# Altium schematic sheet 24V Multiphase Buck.SchDoc: 24V Multiphase Buck
size Tabloid; DrawnBy: Paul Kokhanov; Organization: UWRT; Revision: 2.0; SheetNumber: 1; SheetTotal: 1
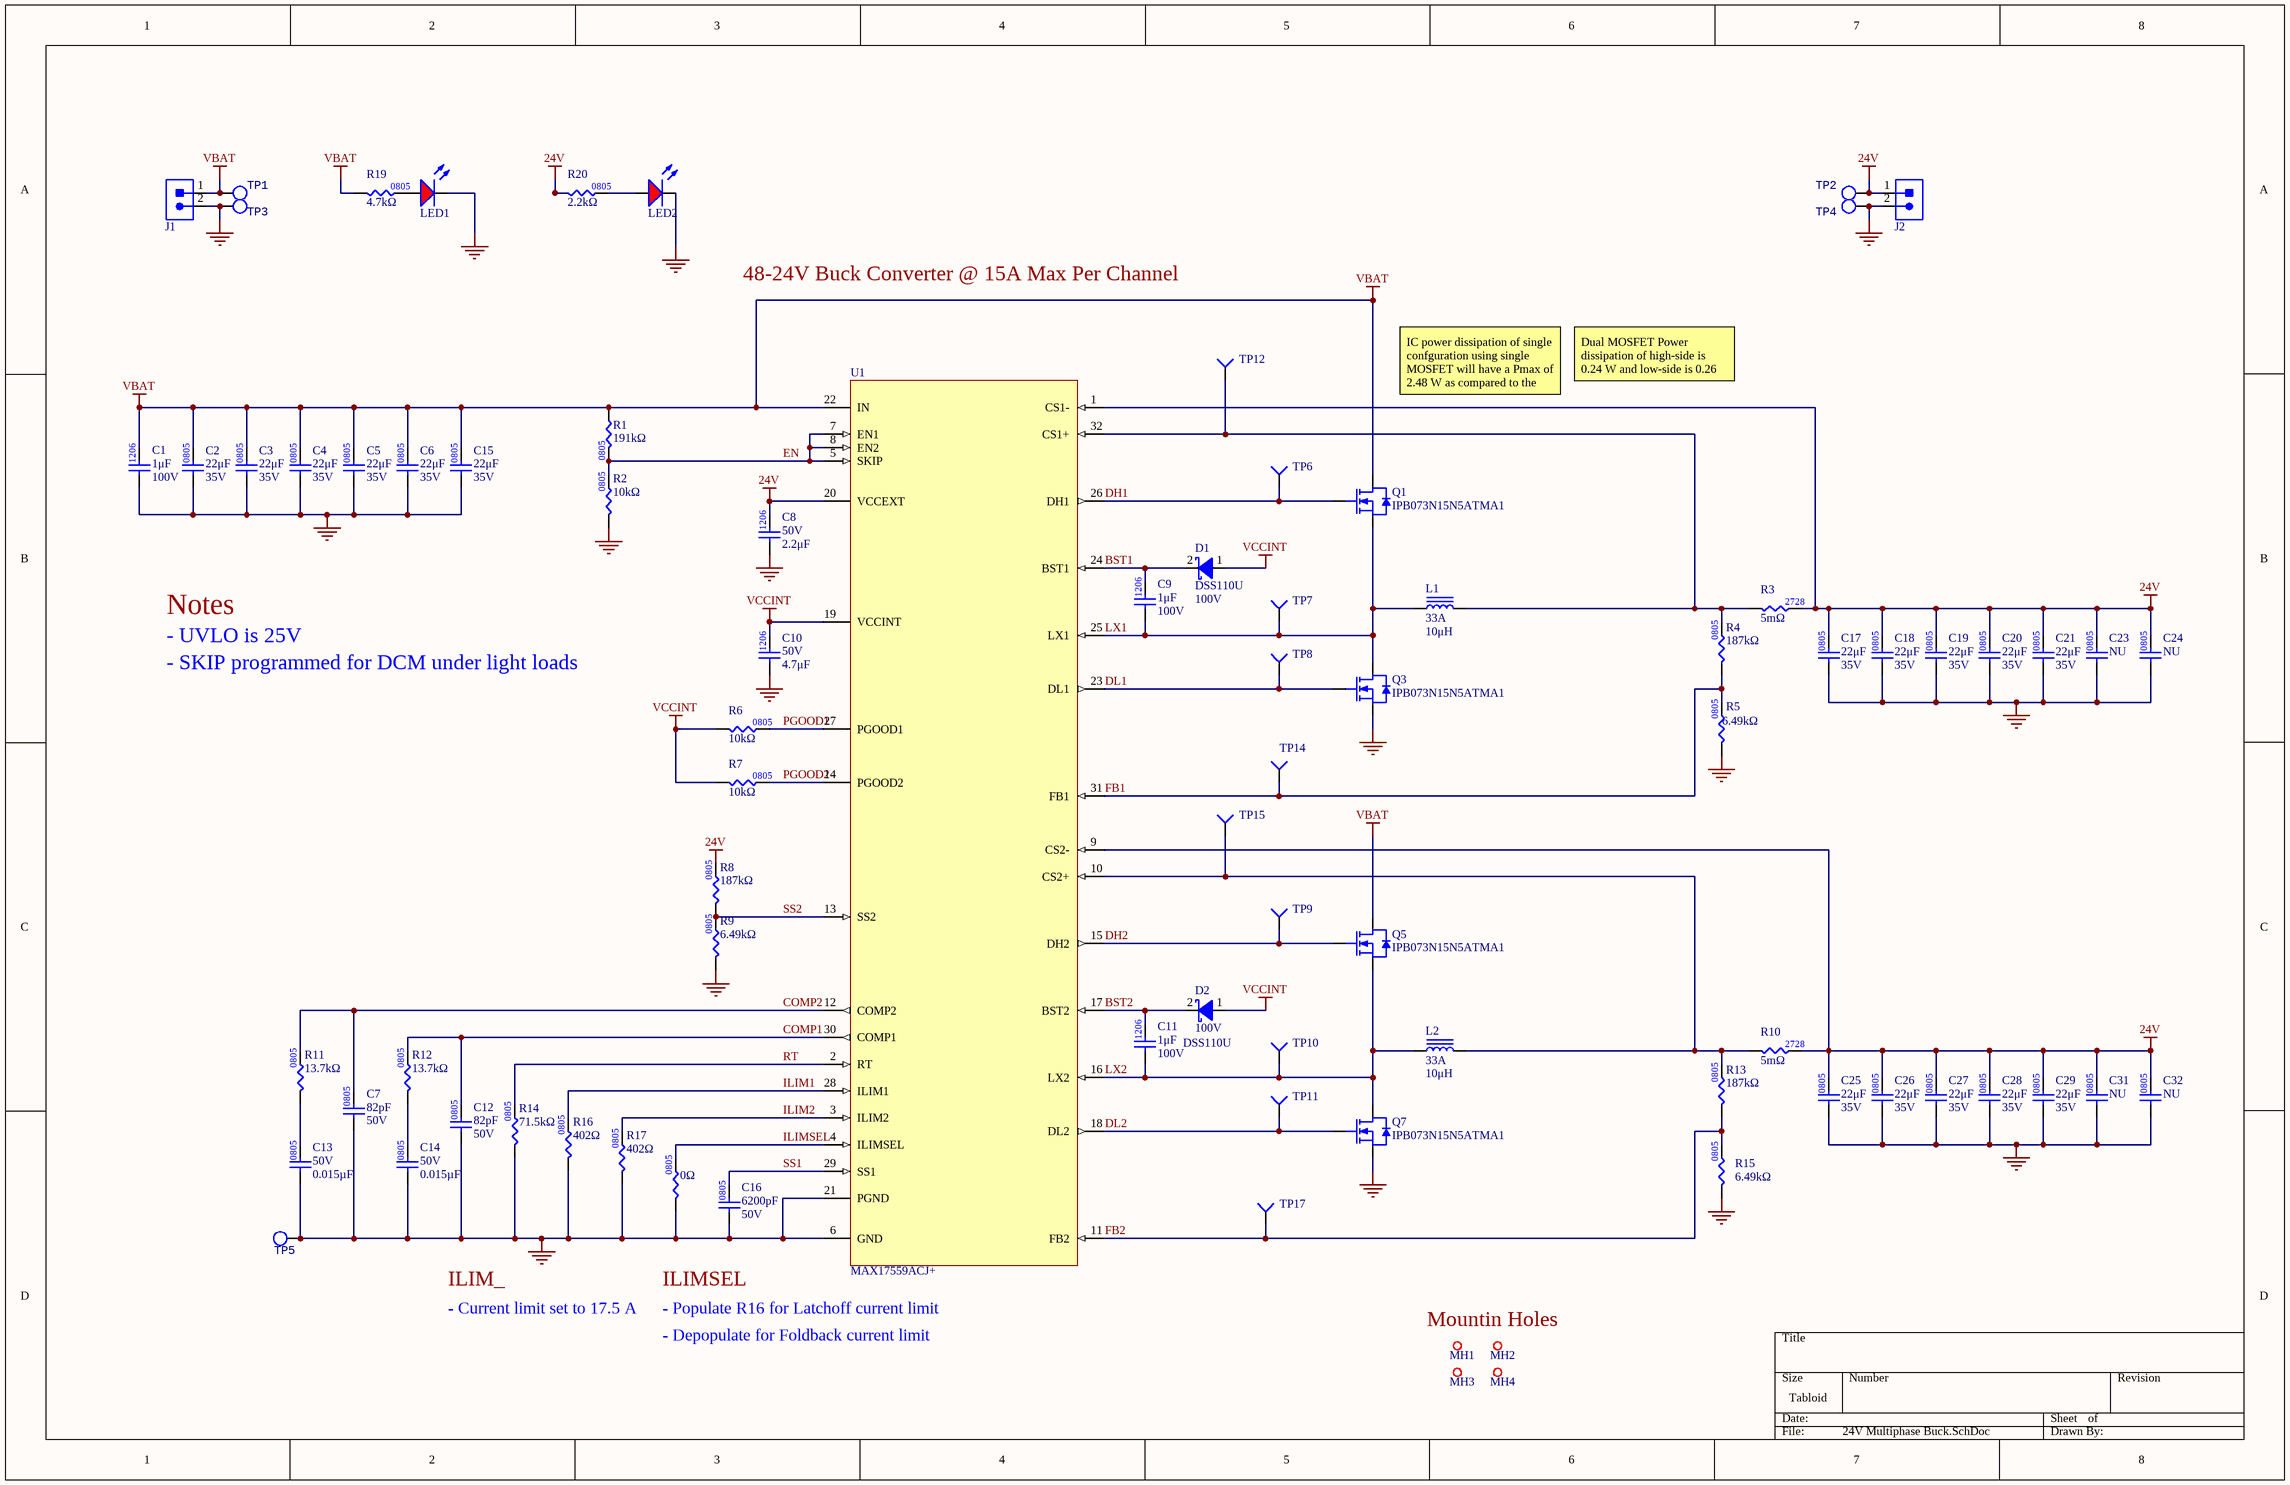
[diagram p0: 24V Multiphase Buck.SchDoc]

## Parts
C1  value 1μF  Voltage Rating: 100V  [CAPC3216X190X50NL20T25]  (hidden comment: CAP_1uF_100V_1206)
C2  value 22μF  Voltage Rating: 35V  [CAP1206]  (hidden comment: CAP_22uF_35V_1206)
C3  value 22μF  Voltage Rating: 35V  [CAP1206]  (hidden comment: CAP_22uF_35V_1206)
C4  value 22μF  Voltage Rating: 35V  [CAP1206]  (hidden comment: CAP_22uF_35V_1206)
C5  value 22μF  Voltage Rating: 35V  [CAP1206]  (hidden comment: CAP_22uF_35V_1206)
C6  value 22μF  Voltage Rating: 35V  [CAP1206]  (hidden comment: CAP_22uF_35V_1206)
C7  value 82pF  Voltage Rating: 50V  [CAP0603]  (hidden comment: CAP_82pF_50V_0603)
C8  value 2.2μF  Voltage Rating: 50V  [CAP1206]  (hidden comment: CAP_2.2uF_50V_1206)
C9  value 1μF  Voltage Rating: 100V  [CAPC3216X190X50NL20T25]  (hidden comment: CAP_1uF_100V_1206)
C10  value 4.7μF  Voltage Rating: 50V  [CAP1206]  (hidden comment: CAP_4.7uF_50V_1206)
C11  value 1μF  Voltage Rating: 100V  [CAPC3216X190X50NL20T25]  (hidden comment: CAP_1uF_100V_1206)
C12  value 82pF  Voltage Rating: 50V  [CAP0603]  (hidden comment: CAP_82pF_50V_0603)
C13  value 0.015µF  Voltage Rating: 50V  [CAP0805]  (hidden comment: CAP_0.015uF_50V_0805)
C14  value 0.015µF  Voltage Rating: 50V  [CAP0805]  (hidden comment: CAP_0.015uF_50V_0805)
C15  value 22μF  Voltage Rating: 35V  [CAP1206]  (hidden comment: CAP_22uF_35V_1206)
C16  Capacitance: 6200pF  Voltage Rating: 50V  [CAP0805]  (hidden comment: CAP_6200pF_50V_0805)
C17  value 22μF  Voltage Rating: 35V  [CAP1206]  (hidden comment: CAP_22uF_35V_1206)
C18  value 22μF  Voltage Rating: 35V  [CAP1206]  (hidden comment: CAP_22uF_35V_1206)
C19  value 22μF  Voltage Rating: 35V  [CAP1206]  (hidden comment: CAP_22uF_35V_1206)
C20  value 22μF  Voltage Rating: 35V  [CAP1206]  (hidden comment: CAP_22uF_35V_1206)
C21  value 22μF  Voltage Rating: 35V  [CAP1206]  (hidden comment: CAP_22uF_35V_1206)
C23  value NU  [CAP1206]  (hidden comment: CAP_NU_1206)
C24  value NU  [CAP1206]  (hidden comment: CAP_NU_1206)
C25  value 22μF  Voltage Rating: 35V  [CAP1206]  (hidden comment: CAP_22uF_35V_1206)
C26  value 22μF  Voltage Rating: 35V  [CAP1206]  (hidden comment: CAP_22uF_35V_1206)
C27  value 22μF  Voltage Rating: 35V  [CAP1206]  (hidden comment: CAP_22uF_35V_1206)
C28  value 22μF  Voltage Rating: 35V  [CAP1206]  (hidden comment: CAP_22uF_35V_1206)
C29  value 22μF  Voltage Rating: 35V  [CAP1206]  (hidden comment: CAP_22uF_35V_1206)
C31  value NU  [CAP1206]  (hidden comment: CAP_NU_1206)
C32  value NU  [CAP1206]  (hidden comment: CAP_NU_1206)
D1  Manufacturer Part Number 1: DSS110U  Vr (Max): 100V  [SOD-123FL]  (hidden comment: DIO_SCHOTTKY_100V_1A)
D2  Manufacturer Part Number 1: DSS110U  Vr (Max): 100V  [SOD-123FL]  (hidden comment: DIO_SCHOTTKY_100V_1A)
J1  CON_2POS_SCREW_TERM  [CON_2POS_SCREW_TERM_65A]  (value not drawn)
J2  CON_2POS_SCREW_TERM  [CON_2POS_SCREW_TERM_65A]  (value not drawn)
L1  Current Rating: 33A  Inductance: 10μH  [IND_B82559B7103A027]  (hidden comment: IND_10uH_33A_SMD)
L2  Current Rating: 33A  Inductance: 10μH  [IND_B82559B7103A027]  (hidden comment: IND_10uH_33A_SMD)
LED1  LED_RED  [LED_0805_RED]  (value not drawn)
LED2  LED_RED  [LED_0805_RED]  (value not drawn)
MH1  MOUNTING_HOLE_M3  [MOUNTING_HOLE_3mm]  (value not drawn)  (no BOM)
MH2  MOUNTING_HOLE_M3  [MOUNTING_HOLE_3mm]  (value not drawn)  (no BOM)
MH3  MOUNTING_HOLE_M3  [MOUNTING_HOLE_3mm]  (value not drawn)  (no BOM)
MH4  MOUNTING_HOLE_M3  [MOUNTING_HOLE_3mm]  (value not drawn)  (no BOM)
Q1  Manufacturer Part Number 1: IPB073N15N5ATMA1  [NMOS_DPAK263-3-2]  (hidden comment: NMOS_150V_114A)
Q3  Manufacturer Part Number 1: IPB073N15N5ATMA1  [NMOS_DPAK263-3-2]  (hidden comment: NMOS_150V_114A)
Q5  Manufacturer Part Number 1: IPB073N15N5ATMA1  [NMOS_DPAK263-3-2]  (hidden comment: NMOS_150V_114A)
Q7  Manufacturer Part Number 1: IPB073N15N5ATMA1  [NMOS_DPAK263-3-2]  (hidden comment: NMOS_150V_114A)
R1  value 191kΩ  [RES0805]  (hidden comment: RES_191kΩ_0805_1%)
R2  value 10kΩ  [RES0805]  (hidden comment: RES_10kΩ_0805_5%)
R3  value 5mΩ  [RES2728]  (hidden comment: RES_5mΩ_2728_1%)
R4  value 187kΩ  [RES0805]  (hidden comment: RES_187kΩ_0805_0.1%)
R5  value 6.49kΩ  [RES0805]  (hidden comment: RES_6.49kΩ_0805_1%)
R6  value 10kΩ  [RES0805]  (hidden comment: RES_10kΩ_0805_5%)
R7  value 10kΩ  [RES0805]  (hidden comment: RES_10kΩ_0805_5%)
R8  value 187kΩ  [RES0805]  (hidden comment: RES_187kΩ_0805_0.1%)
R9  value 6.49kΩ  [RES0805]  (hidden comment: RES_6.49kΩ_0805_1%)
R10  value 5mΩ  [RES2728]  (hidden comment: RES_5mΩ_2728_1%)
R11  value 13.7kΩ  [RES0805]  (hidden comment: RES_13.7kΩ_0805_1%)
R12  value 13.7kΩ  [RES0805]  (hidden comment: RES_13.7kΩ_0805_1%)
R13  value 187kΩ  [RES0805]  (hidden comment: RES_187kΩ_0805_0.1%)
R14  value 71.5kΩ  [RES0805]  (hidden comment: RES_71.5kΩ_0805_1%)
R15  value 6.49kΩ  [RES0805]  (hidden comment: RES_6.49kΩ_0805_1%)
R16  value 402Ω  [RES0805]  (hidden comment: RES_402Ω_0805_1%)
R17  value 402Ω  [RES0805]  (hidden comment: RES_402Ω_0805_1%)
R18  value 0Ω  [RES0805]  (hidden comment: RES_0Ω_0805)
R19  value 4.7kΩ  [RES0805]  (hidden comment: RES_4.7kΩ_0805_5%)
R20  value 2.2kΩ  [RES0805]  (hidden comment: RES_2.2kΩ_0805_5%)
TP1  TESTPOINT_LOOP  [TESTPOINT_LOOP]  (value not drawn)
TP2  TESTPOINT_LOOP  [TESTPOINT_LOOP]  (value not drawn)
TP3  TESTPOINT_LOOP  [TESTPOINT_LOOP]  (value not drawn)
TP4  TESTPOINT_LOOP  [TESTPOINT_LOOP]  (value not drawn)
TP5  TESTPOINT_LOOP  [TESTPOINT_LOOP]  (value not drawn)
TP6  TESTPOINT_1MM_CIRCLE  [TESTPOINT_CIRCLE_1MM]  (value not drawn)  (no BOM)
TP7  TESTPOINT_1MM_CIRCLE  [TESTPOINT_CIRCLE_1MM]  (value not drawn)  (no BOM)
TP8  TESTPOINT_1MM_CIRCLE  [TESTPOINT_CIRCLE_1MM]  (value not drawn)  (no BOM)
TP9  TESTPOINT_1MM_CIRCLE  [TESTPOINT_CIRCLE_1MM]  (value not drawn)  (no BOM)
TP10  TESTPOINT_1MM_CIRCLE  [TESTPOINT_CIRCLE_1MM]  (value not drawn)  (no BOM)
TP11  TESTPOINT_1MM_CIRCLE  [TESTPOINT_CIRCLE_1MM]  (value not drawn)  (no BOM)
TP12  TESTPOINT_1MM_CIRCLE  [TESTPOINT_CIRCLE_1MM]  (value not drawn)  (no BOM)
TP14  TESTPOINT_1MM_CIRCLE  [TESTPOINT_CIRCLE_1MM]  (value not drawn)  (no BOM)
TP15  TESTPOINT_1MM_CIRCLE  [TESTPOINT_CIRCLE_1MM]  (value not drawn)  (no BOM)
TP17  TESTPOINT_1MM_CIRCLE  [TESTPOINT_CIRCLE_1MM]  (value not drawn)  (no BOM)
U1  MAX17559ACJ+  [IC_32-TQFP]

## Nets
24V: C8.2 C17.2 C18.2 C19.2 C20.2 C21.2 C23.2 C24.2 C25.2 C26.2 C27.2 C28.2 C29.2 C31.2 C32.2 J2.1 R3.2 R8.2 R10.2 R20.1 TP2.1 U1.1(CS1-) U1.9(CS2-) U1.20(VCCEXT)
GND: C1.1 C2.1 C3.1 C4.1 C5.1 C6.1 C7.1 C8.1 C10.1 C12.1 C13.1 C14.1 C15.1 C16.1 C17.1 C18.1 C19.1 C20.1 C21.1 C23.1 C24.1 C25.1 C26.1 C27.1 C28.1 C29.1 C31.1 C32.1 J1.2 J2.2 LED1.2(K) LED2.2(K) Q3.3(SOURCE) Q7.3(SOURCE) R2.1 R5.1 R9.1 R14.1 R15.1 R16.1 R17.1 R18.1 TP3.1 TP4.1 TP5.1 U1.6(GND) U1.21(PGND)
VBAT: C1.2 C2.2 C3.2 C4.2 C5.2 C6.2 C15.2 J1.1 Q1.2(DRAIN) Q5.2(DRAIN) R1.2 R19.1 TP1.1 U1.22(IN)
VCCINT: C10.2 D1.1(Anode) D2.1(Anode) R6.1 R7.1 U1.19(VCCINT)
BST1: C9.2 D1.2(Cathode) U1.24(BST1)
BST2: C11.2 D2.2(Cathode) U1.17(BST2)
COMP1: C12.2 R12.2 U1.30(COMP1)
COMP2: C7.2 R11.2 U1.12(COMP2)
DH1: Q1.1(GATE) TP6.1(=value) U1.26(DH1)
DH2: Q5.1(GATE) TP9.1(=value) U1.15(DH2)
DL1: Q3.1(GATE) TP8.1(=value) U1.23(DL1)
DL2: Q7.1(GATE) TP11.1(=value) U1.18(DL2)
EN: R1.1 R2.2 U1.5(SKIP) U1.7(EN1) U1.8(EN2)
FB1: R4.1 R5.2 TP14.1(=value) U1.31(FB1)
FB2: R13.1 R15.2 TP17.1(=value) U1.11(FB2)
ILIM1: R16.2 U1.28(ILIM1)
ILIM2: R17.2 U1.3(ILIM2)
ILIMSEL: R18.2 U1.4(ILIMSEL)
LX1: C9.1 L1.1 Q1.3(SOURCE) Q3.2(DRAIN) TP7.1(=value) U1.25(LX1)
LX2: C11.1 L2.1 Q5.3(SOURCE) Q7.2(DRAIN) TP10.1(=value) U1.16(LX2)
PGOOD1: R6.2 U1.27(PGOOD1)
PGOOD2: R7.2 U1.14(PGOOD2)
RT: R14.2 U1.2(RT)
SS1: C16.2 U1.29(SS1)
SS2: R8.1 R9.2 U1.13(SS2)
NetC13_2: C13.2 R11.1
NetC14_2: C14.2 R12.1
NetL1_2: L1.2 R3.1 R4.2 TP12.1(=value) U1.32(CS1+)
NetL2_2: L2.2 R10.1 R13.2 TP15.1(=value) U1.10(CS2+)
NetLED1_1: LED1.1(A) R19.2
NetLED2_1: LED2.1(A) R20.2

## Notes on the sheet
- 48-24V Buck Converter @ 15A Max Per Channel
- IC power dissipation of single confguration using single MOSFET will have a Pmax of 2.48 W as compared to the Dual MOSFET with Pmax of 4.77 W. The concern with the dual configuration is the the IC junction temperature is 178 degrees, whereas as per the MAX17559 information sheet suggests we do not exceed a TJ of 125 degrees. The single configuration has a TJ of 111 degrees. Having a high TJ can cause functionality and preformance issues. Essentially we would have to monitor this or use some cooling method or change the switching frequency.
- Dual MOSFET Power dissipation of high-side is 0.24 W and low-side is 0.26 W. Single MOSFET Power dissipation of high-side is 0.96 W and low-side is 0.86 W. It is desirable to have a lower Power dissipation, hence overall, since space is not a concern on this design, we should keep both MOSFETS but one shall be blank.
- Notes
- - SKIP programmed for DCM under light loads
- - UVLO is 25V
- ILIM_
- ILIMSEL
- - Current limit set to 17.5 A
- - Populate R16 for Latchoff current limit
- - Depopulate for Foldback current limit
- Mountin Holes
- (in symbol CAP_2.2uF_50V_1206) 1206
- (in symbol CAP_22uF_35V_1206) 0805
- (in symbol CAP_82pF_50V_0603) 0805
- (in symbol CAP_NU_1206) 0805

## Library data of the parts
C1 C9 C11 = CAP_1uF_100V_1206: CAP CER 1UF 100V X7R 1206; Supplier 1: Digi-Key; Mounting Type: SMD; Package: 1206; Supplier Part Number 1: 490-16468-1-ND
C2-C6 C15 C17-C21 C25-C29 = CAP_22uF_35V_1206: CAP CER 22UF 35V X5R 1206; Manufacturer 1: TDK Corporation; Manufacturer Part Number 1: C3216X5R1V226M160AC; Package/Footprint: 1205; Mounting Type: Surface Mount; Supplier 1: Digi-Key; Supplier Part Number 1: 445-8045-1-ND; Dielectric: X5R
C7 C12 = CAP_82pF_50V_0603: CAP CER 82PF 50V C0G/NPO 0603; Manufacturer 1: Yageo; Manufacturer Part Number 1: CC0603JRNPO9BN820; Dielectric: C0G, NP0; Supplier 1: Digi-Key; Supplier Part Number 1: 311-1068-1-ND
C8 = CAP_2.2uF_50V_1206: CAP CER 2.2UF 50V X7R 1206; Manufacturer 1: Murata Electronics; Manufacturer Part Number 1: GCM31CR71H225KA55L; Supplier Part Number 1: 490-4796-1-ND; Supplier 1: Digi-Key; Dielectric: X7R
C10 = CAP_4.7uF_50V_1206: CAP CER 4.7UF 50V X7R 1206; Manufacturer 1: Murata; Manufacturer Part Number 1: GRM31CR71H475KA12L; Supplier 1: Digi-Key; Mounting Type: SMD; Supplier Part Number 1: 490-6521-1-ND; Dielectric: X7R; Package: 1206
C13 C14 = CAP_0.015uF_50V_0805: CAP CER 0.015UF 50V C0G 0805; Manufacturer 1: TDK Corporation; Manufacturer Part Number 1: CGA4F2C0G1H153J085AA; Package: 0805; Supplier 1: Digi-Key; Supplier Part Number 1: 445-6948-1-ND
C16 = CAP_6200pF_50V_0805: CAP CER 6200PF 50V C0G/NP0 0805; Manufacturer 1: Murata Electronics; Manufacturer Part Number 1: GRM2195C1H622JA01D; Package/Footprint: 0805; Supplier 1: Digi-Key; Supplier Part Number 1: 490-1637-1-ND
C23 C24 C31 C32 = CAP_NU_1206: PLACEHOLDER CAPACITOR; Mounting Type: Surface Mount; Package: 1206
D1 D2 = DIO_SCHOTTKY_100V_1A: DIODE SCHOTTKY 100V 1A SOD-123F; Manufacturer 1: SMC Diode Solutions; Supplier 1: Digi-Key; Supplier Part Number 1: 1655-DSS110UCT-ND; Mounting Type: SMD; Package/Footprint: SOD-123F
J1 J2 = CON_2POS_SCREW_TERM_65A: PCB TERMINAL BLOCKS RISING CLAMP; Manufacturer 1: Amphenol Anytek; Manufacturer Part Number 1: VP0265840000G; Supplier 1: Digi-Key; Mounting Type: TH; Package/Footprint: TERMINAL; Supplier Part Number 1: 1818-VP0265840000G-ND
L1 L2 = IND_10uH_33A_SMD: FIXED IND 10UH 33A 1.92 MOHM SMD; Manufacturer 1: EPCOS - TDK Electronics; Manufacturer Part Number 1: B82559B7103A027; Supplier Part Number 1: 495-B82559B7103A027CT-ND; Supplier 1: Digi-Key
LED1 LED2 = LED_RED: LED RED DIFFUSED 0805 SMD; Manufacturer 1: OSRAM; Manufacturer Part Number 1: LS R976-NR-1; Package/Footprint: 0805; Forward Voltage Drop: 2V; Supplier Part Number 1: 475-1278-1-ND; Supplier 1: Digi-Key; Mounting Type: SMD
Q1 Q3 Q5 Q7 = NMOS_150V_114A: MOSFET N-CH 150V 114A TO263-3; Manufacturer 1: Infineon Technologies; Package/Footprint: TO-263-3, D²Pak; Vgs (Max): ±20V; Supplier 1: Digi-Key; Supplier Part Number 1: IPB073N15N5ATMA1CT-ND; Vdss: 150V; Mounting Type: SMD; Id: 114A
R1 = RES_191kΩ_0805_1%: RES 191K OHM 1% 1/8W 0805; Manufacturer 1: Yageo; Manufacturer Part Number 1: RC0805FR-07191KL; Package/Footprint: 0805; Supplier Part Number 1: 311-191KCRTR-ND; Supplier 1: Digi-Key; Mounting Type: SMD
R2 R6 R7 = RES_10kΩ_0805_5%: RES 10K OHM 5% 1/8W 0805; Manufacturer 1: Panasonic Electronic Components; Manufacturer Part Number 1: ERJ-6GEYJ103V; Package/Footprint: 0805; Supplier 1: Digi-Key; Supplier Part Number 1: P10KACT-ND; LCSC Part #: C17414; Mounting Type: SMD
R3 R10 = RES_5mΩ_2728_1%: RES 0.005 OHM 1% 4W 2827; Manufacturer 1: Stackpole Electronics Inc; Manufacturer Part Number 1: CSSH2728FT5L00; Package/Footprint: 2728; Mounting Type: SMD; Supplier 1: Digi-Key; Supplier Part Number 1: CSSH2728FT5L00CT-ND
R4 R8 R13 = RES_187kΩ_0805_0.1%: RES 187K OHM 0.1% 1/8W 0805; Manufacturer 1: Yageo; Manufacturer Part Number 1: RT0805BRD07187KL; Package/Footprint: 0805; Supplier Part Number 1: 13-RT0805BRD07187KLCT-ND; Supplier 1: Digi-Key; Mounting Type: SMD
R5 R9 R15 = RES_6.49kΩ_0805_1%: RES 6.49K OHM 1% 1/8W 0805; Manufacturer 1: Yageo; Manufacturer Part Number 1: RC0805FR-076K49L; Package/Footprint: 0805; Mounting Type: SMD; Supplier 1: Digi-Key; Supplier Part Number 1: 311-6.49KCRCT-ND
R11 R12 = RES_13.7kΩ_0805_1%: RES 13.7K OHM 1% 1/8W 0805; Manufacturer 1: Vishay; Manufacturer Part Number 1: CRCW080513K7FKEA; Supplier 1: Digi-Key; Supplier Part Number 1: 541-13.7KCCT-ND; LCSC Part #: C17448; Mounting Type: SMD; Package: 0805
R14 = RES_71.5kΩ_0805_1%: RES 71.5K OHM 1% 1/8W 0805; Manufacturer 1: Yageo; Manufacturer Part Number 1: RC0805FR-0771K5L; Package/Footprint: 0805; Mounting Type: SMD; Supplier 1: Digi-Key; Supplier Part Number 1: 311-71.5KCRCT-ND
R16 R17 = RES_402Ω_0805_1%: RES 402 OHM 1% 1/8W 0805; Manufacturer 1: Stackpole Electronics Inc; Manufacturer Part Number 1: RMCF0805FT402R; Package/Footprint: 0805; Supplier 1: Digi-Key; Supplier Part Number 1: RMCF0805FT402RCT-ND; Mounting Type: SMD; LCSC Part #: C17681
R18 = RES_0Ω_0805: RES 0 OHM JUMPER 1/8W 0805; Manufacturer 1: YAGEO; Manufacturer Part Number 1: RC0805JR-070RL; Package/Footprint: 0805; Supplier Part Number 1: 311-0.0ARCT-ND; Supplier 1: Digi-Key; Mounting Type: SMD
R19 = RES_4.7kΩ_0805_5%: RES 4.7K OHM 5% 1/8W 0805; Manufacturer 1: Yageo; Manufacturer Part Number 1: RC0805JR-074K7L; Supplier 1: Digi-Key; Supplier Part Number 1: 311-4.7KARCT-ND; Mounting Type: SMD; LCSC Part #: C17673; Package: 0805
R20 = RES_2.2kΩ_0805_5%: RES 2.2K OHM 5% 1/8W 0805; Manufacturer 1: Vishay Dale; Manufacturer Part Number 1: CRCW08052K20JNEAC; Supplier 1: Digi-Key; Supplier Part Number 1: 541-4169-1-ND; Tolerance: 5%; Package: 0805
TP1-TP5 = TESTPOINT_LOOP: TESTPOINT THRUHOLE; Manufacturer 1: Keystone Electronics; Manufacturer Part Number 1: 5002; Package/Footprint: TH; Supplier Part Number 1: 36-5002-ND; Supplier 1: Digi-Key; Mounting Type: TH
TP6-TP12 TP14 TP15 TP17 = TESTPOINT_1MM_CIRCLE: TESTPOINT 1MM CIRCLE
U1 = MAX17559ACJ+: IC REG CTRLR BUCK 32TQFP; Manufacturer 1: Maxim; Package/Footprint: 32-TQFP; Supplier 1: Digi-Key; Mounting Type: SMD; Supplier Part Number 1: MAX17559ACJ+-ND; Manufacturer Part Number: MAX17559ACJ+